# Altium schematic sheet Memory.SchDoc
size Legal; SheetNumber: 10; SheetTotal: 12
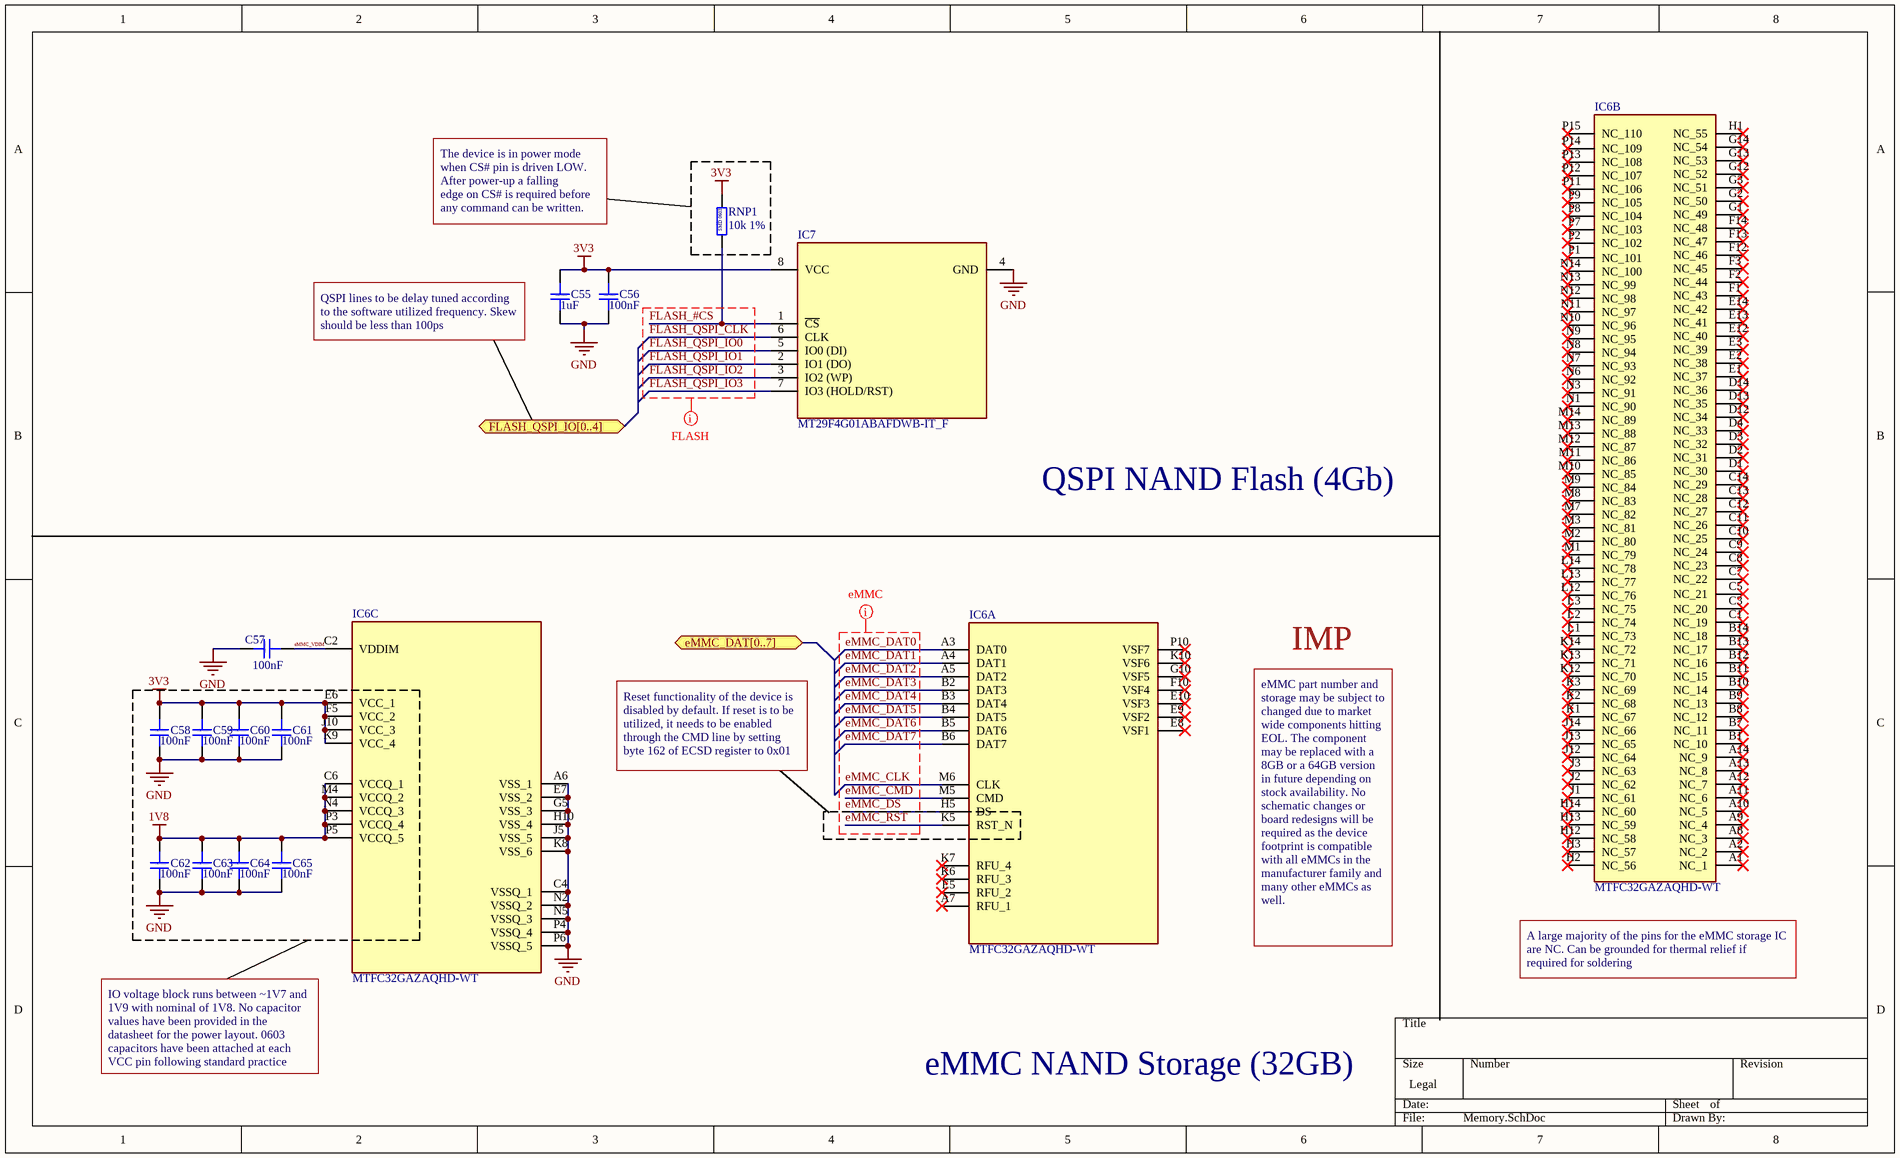
[diagram p0: Memory.SchDoc]

## Parts
C55  1uF  [CAP_0402]
C56  100nF  [CAP_0402]
C57  100nF  [CAP_0402]
C58  100nF  [CAP_0402]
C59  100nF  [CAP_0402]
C60  100nF  [CAP_0402]
C61  100nF  [CAP_0402]
C62  100nF  [CAP_0402]
C63  100nF  [CAP_0402]
C64  100nF  [CAP_0402]
C65  100nF  [CAP_0402]
IC6  MTFC32GAZAQHD-WT  [BGA153C50P14X14_1150X1300X90]  (parts A,B,C of 3)
IC7  MT29F4G01ABAFDWB-IT_F  [SON127P800X600X65-8N]
RNP1  10k 1%  [RES_0603]

## Ports
eMMC_DAT[0..7] (bidir), FLASH_QSPI_IO[0..4] (bidir)

## Nets
1V8: C62.1 C63.1 C64.1 C65.1 IC6.C6(VCCQ_1) IC6.M4(VCCQ_2) IC6.N4(VCCQ_3) IC6.P3(VCCQ_4) IC6.P5(VCCQ_5)
3V3: C55.1 C56.1 C58.1 C59.1 C60.1 C61.1 IC6.E6(VCC_1) IC6.F5(VCC_2) IC6.J10(VCC_3) IC6.K9(VCC_4) IC7.8(VCC) RNP1.2
GND: C55.2 C56.2 C57.1 C58.2 C59.2 C60.2 C61.2 C62.2 C63.2 C64.2 C65.2 IC6.A6(VSS_1) IC6.C4(VSSQ_1) IC6.E7(VSS_2) IC6.G5(VSS_3) IC6.H10(VSS_4) IC6.J5(VSS_5) IC6.K8(VSS_6) IC6.N2(VSSQ_2) IC6.N5(VSSQ_3) IC6.P4(VSSQ_4) IC6.P6(VSSQ_5) IC7.4(GND)
eMMC_CLK: IC6.M6(CLK)
eMMC_CMD: IC6.M5(CMD)
eMMC_DAT0: IC6.A3(DAT0)
eMMC_DAT1: IC6.A4(DAT1)
eMMC_DAT2: IC6.A5(DAT2)
eMMC_DAT3: IC6.B2(DAT3)
eMMC_DAT4: IC6.B3(DAT4)
eMMC_DAT5: IC6.B4(DAT5)
eMMC_DAT6: IC6.B5(DAT6)
eMMC_DAT7: IC6.B6(DAT7)
eMMC_DS: IC6.H5(DS)
eMMC_RST: IC6.K5(RST_N)
eMMC_VDIM: C57.2 IC6.C2(VDDIM)
FLASH_#CS: IC7.1(~{CS}) RNP1.1
FLASH_QSPI_CLK: IC7.6(CLK)
FLASH_QSPI_IO0: IC7.5(IO0_(DI))
FLASH_QSPI_IO1: IC7.2(IO1_(DO))
FLASH_QSPI_IO2: IC7.3(IO2_(WP))
FLASH_QSPI_IO3: IC7.7(IO3_(HOLD/RST))

Not connected (* = marked no-connect by the designer): IC6 A1(NC_1)* A2(NC_2)* A7(RFU_1)* A8(NC_3)* A9(NC_4)* A10(NC_5)* A11(NC_6)* A12(NC_7)* A13(NC_8)* A14(NC_9)* B1(NC_10)* B7(NC_11)* B8(NC_12)* B9(NC_13)* B10(NC_14)* B11(NC_15)* B12(NC_16)* B13(NC_17)* B14(NC_18)* C1(NC_19)* C3(NC_20)* C5(NC_21)* C7(NC_22)* C8(NC_23)* C9(NC_24)* C10(NC_25)* C11(NC_26)* C12(NC_27)* C13(NC_28)* C14(NC_29)* D1(NC_30)* D2(NC_31)* D3(NC_32)* D4(NC_33)* D12(NC_34)* D13(NC_35)* D14(NC_36)* E1(NC_37)* E2(NC_38)* E3(NC_39)* E5(RFU_2)* E8(VSF1)* E9(VSF2)* E10(VSF3)* E12(NC_40)* E13(NC_41)* E14(NC_42)* F1(NC_43)* F2(NC_44)* F3(NC_45)* F10(VSF4)* F12(NC_46)* F13(NC_47)* F14(NC_48)* G1(NC_49)* G2(NC_50)* G3(NC_51)* G10(VSF5)* G12(NC_52)* G13(NC_53)* G14(NC_54)* H1(NC_55)* H2(NC_56)* H3(NC_57)* H12(NC_58)* H13(NC_59)* H14(NC_60)* J1(NC_61)* J2(NC_62)* J3(NC_63)* J12(NC_64)* J13(NC_65)* J14(NC_66)* K1(NC_67)* K2(NC_68)* K3(NC_69)* K6(RFU_3)* K7(RFU_4)* K10(VSF6)* K12(NC_70)* K13(NC_71)* K14(NC_72)* L1(NC_73)* L2(NC_74)* L3(NC_75)* L12(NC_76)* L13(NC_77)* L14(NC_78)* M1(NC_79)* M2(NC_80)* M3(NC_81)* M7(NC_82)* M8(NC_83)* M9(NC_84)* M10(NC_85)* M11(NC_86)* M12(NC_87)* M13(NC_88)* M14(NC_89)* N1(NC_90)* N3(NC_91)* N6(NC_92)* N7(NC_93)* N8(NC_94)* N9(NC_95)* N10(NC_96)* N11(NC_97)* N12(NC_98)* N13(NC_99)* N14(NC_100)* P1(NC_101)* P2(NC_102)* P7(NC_103)* P8(NC_104)* P9(NC_105)* P10(VSF7)* P11(NC_106)* P12(NC_107)* P13(NC_108)* P14(NC_109)* P15(NC_110)*

## Layout directives
net class eMMC: eMMC_CLK, eMMC_CMD, eMMC_DAT0, eMMC_DAT1, eMMC_DAT2, eMMC_DAT3, eMMC_DAT4, eMMC_DAT5, eMMC_DAT6, eMMC_DAT7, eMMC_DS, eMMC_RST
net class FLASH; rule Maximum Via Count Constraint [Max Count = 2]; rule Matched Net Lengths [Delay Tolerance = 100ps]: FLASH_#CS, FLASH_QSPI_CLK, FLASH_QSPI_IO0, FLASH_QSPI_IO1, FLASH_QSPI_IO2, FLASH_QSPI_IO3

## Notes on the sheet
- The device is in power mode when CS# pin is driven LOW. After power-up a falling
  edge on CS# is required before any command can be written.
- (near C55) QSPI lines to be delay tuned according to the software utilized frequency. Skew should be less than 100ps
- QSPI NAND Flash (4Gb)
- IMP
- Reset functionality of the device is disabled by default. If reset is to be utilized, it needs to be enabled through the CMD line by setting byte 162 of ECSD register to 0x01
- eMMC part number and storage may be subject to changed due to market wide components hitting EOL. The component may be replaced with a 8GB or a 64GB version in future depending on stock availability. No schematic changes or board redesigns will be required as the device footprint is compatible with all eMMCs in the manufacturer family and many other eMMCs as well.
- A large majority of the pins for the eMMC storage IC are NC. Can be grounded for thermal relief if required for soldering
- (near IC6) IO voltage block runs between ~1V7 and 1V9 with nominal of 1V8. No capacitor values have been provided in the datasheet for the power layout. 0603 capacitors have been attached at each VCC pin following standard practice
- eMMC NAND Storage (32GB)
- (in symbol Capacitor-SMD-0402) SMD 0402
- (in symbol Resistor-SMD-0603) SMD 0603

## Library data of the parts
C55-C65 = Capacitor-SMD-0402: Capacitor SMD 0402 RATED
IC6 = MTFC32GAZAQHD-WT: Integrated Circuit; Manufacturer_Name: Micron; Datasheet Link: https://4donline.ihs.com/images/VipMasterIC/IC/MICT/MICT-S-A0013760855/MICT-S-A0013760855-1.pdf?hkey=52A5661711E402568146F3353EA87419; Height: 0.9mm; Manufacturer_Part_Number: MTFC32GAZAQHD-WT; Mouser Part Number: 340-531307-TRAY; Mouser Price/Stock: https://www.mouser.co.uk/ProductDetail/Micron/MTFC32GAZAQHD-WT?qs=KUoIvG%2F9IlZhoMlKy7eeFw%3D%3D; Arrow Part Number: MTFC32GAZAQHD-WT; Arrow Price/Stock: https://www.arrow.com/en/products/mtfc32gazaqhd-wt/micron-technology?utm_currency=USD&region=nac
IC7 = MT29F4G01ABAFDWB-IT_F: Integrated Circuit; Manufacturer_Name: Micron; Manufacturer_Part_Number: MT29F4G01ABAFDWB-IT:F; Datasheet Link: https://www.farnell.com/datasheets/3151403.pdf; Height: 0.65mm; Mouser Part Number: 340-359563; Mouser Price/Stock: https://www.mouser.co.uk/ProductDetail/Micron/MT29F4G01ABAFDWB-ITF?qs=wUXugUrL1qwrjb7To7JPbA%3D%3D; Arrow Part Number: MT29F4G01ABAFDWB-IT:F; Arrow Price/Stock: null?region=nac
RNP1 = Resistor-SMD-0603: Resistor SMD 0603 RATED